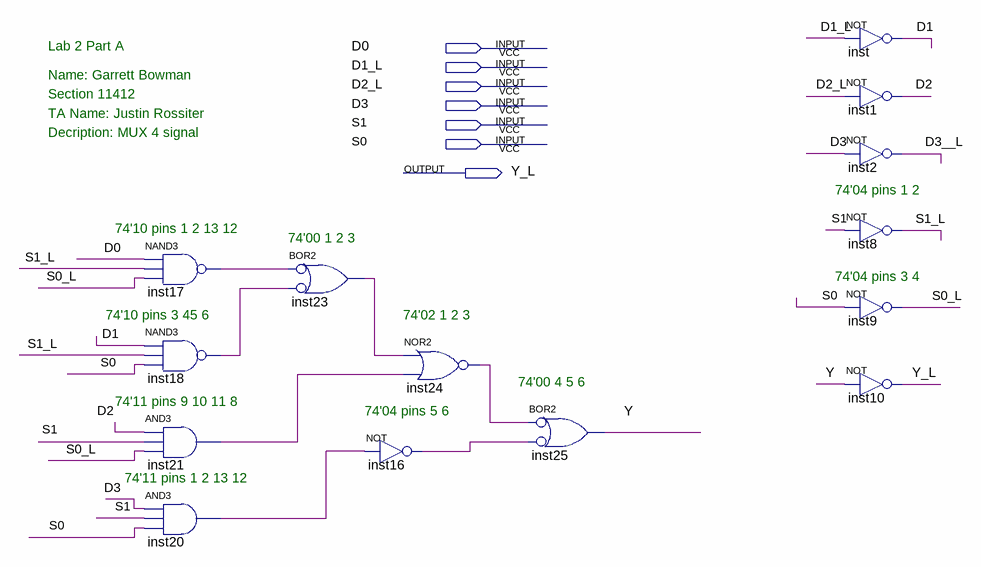
[diagram p0: schematic sheet]
// Quartus schematic Lab2_MUX.bdf as structural Verilog: 14 symbols, 7 pins
module Lab2_MUX (
  input  D0,
  input  D1_L,
  input  D2_L,
  input  D3,
  input  S1,
  input  S0,
  output Y_L
);

  wire D1, D2, D3__L, inst16_out, inst17_out, inst18_out, inst20_out, inst21_out, inst23_out, inst24_out,
       S0_L, S1_L, Y;

  nand inst17 (inst17_out, D0, S1_L, S0_L);
  nand inst18 (inst18_out, D1, S1_L, S0);
  and inst21 (inst21_out, D2, S1, S0_L);
  and inst20 (inst20_out, D3, S1, S0);
  or inst23 (inst23_out, ~inst17_out, ~inst18_out);  // BOR2
  not inst16 (inst16_out, inst20_out);
  nor inst24 (inst24_out, inst23_out, inst21_out);
  or inst25 (Y, ~inst24_out, ~inst16_out);  // BOR2
  not inst (D1, D1_L);
  not inst1 (D2, D2_L);
  not inst2 (D3__L, D3);
  not inst8 (S1_L, S1);
  not inst9 (S0_L, S0);
  not inst10 (Y_L, Y);

  // Notes on the sheet:
  //   Lab 2 Part A
  //   Name: Garrett Bowman
  //   Section 11412
  //   TA Name: Justin Rossiter
  //   Decription: MUX 4 signal
  //   74'04 pins 1 2
  //   74'10 pins 1 2 13 12
  //   74'00 1 2 3
  //   74'04 pins 3 4
  //   74'10 pins 3 45 6
  //   74'02 1 2 3
  //   74'00 4 5 6
  //   74'11 pins 9 10 11 8
  //   74'04 pins 5 6
  //   74'11 pins 1 2 13 12
endmodule
